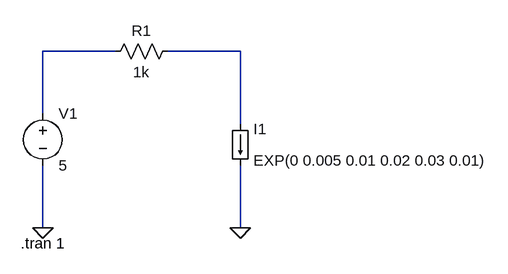
[diagram p0: schematic prueba_carga_arbitraria.asc]
prueba_carga_arbitraria.asc, the LTspice schematic file:
Version 4
SHEET 1 880 680
WIRE -16 -16 -128 -16
WIRE 176 -16 64 -16
WIRE -128 80 -128 -16
WIRE 176 96 176 -16
WIRE -128 256 -128 160
WIRE 176 256 176 160
FLAG 176 256 0
FLAG -128 256 0
SYMBOL load 160 96 R0
WINDOW 123 0 0 Left 0
WINDOW 39 0 0 Left 0
SYMATTR InstName I1
SYMATTR Value EXP(0 0.005 0.01 0.02 0.03 0.01)
SYMBOL voltage -128 64 R0
WINDOW 123 0 0 Left 0
WINDOW 39 0 0 Left 0
SYMATTR InstName V1
SYMATTR Value 5
SYMBOL res 80 -32 R90
WINDOW 0 0 56 VBottom 2
WINDOW 3 32 56 VTop 2
SYMATTR InstName R1
SYMATTR Value 1k
TEXT -162 280 Left 2 !.tran 1

The netlist it stands for:
* prueba_carga_arbitraria.asc
I1 N002 0 EXP(0 0.005 0.01 0.02 0.03 0.01)
V1 N001 0 5
R1 N002 N001 1k
.tran 1
.backanno
.end